# EAGLE design main (EAGLE 5.11)
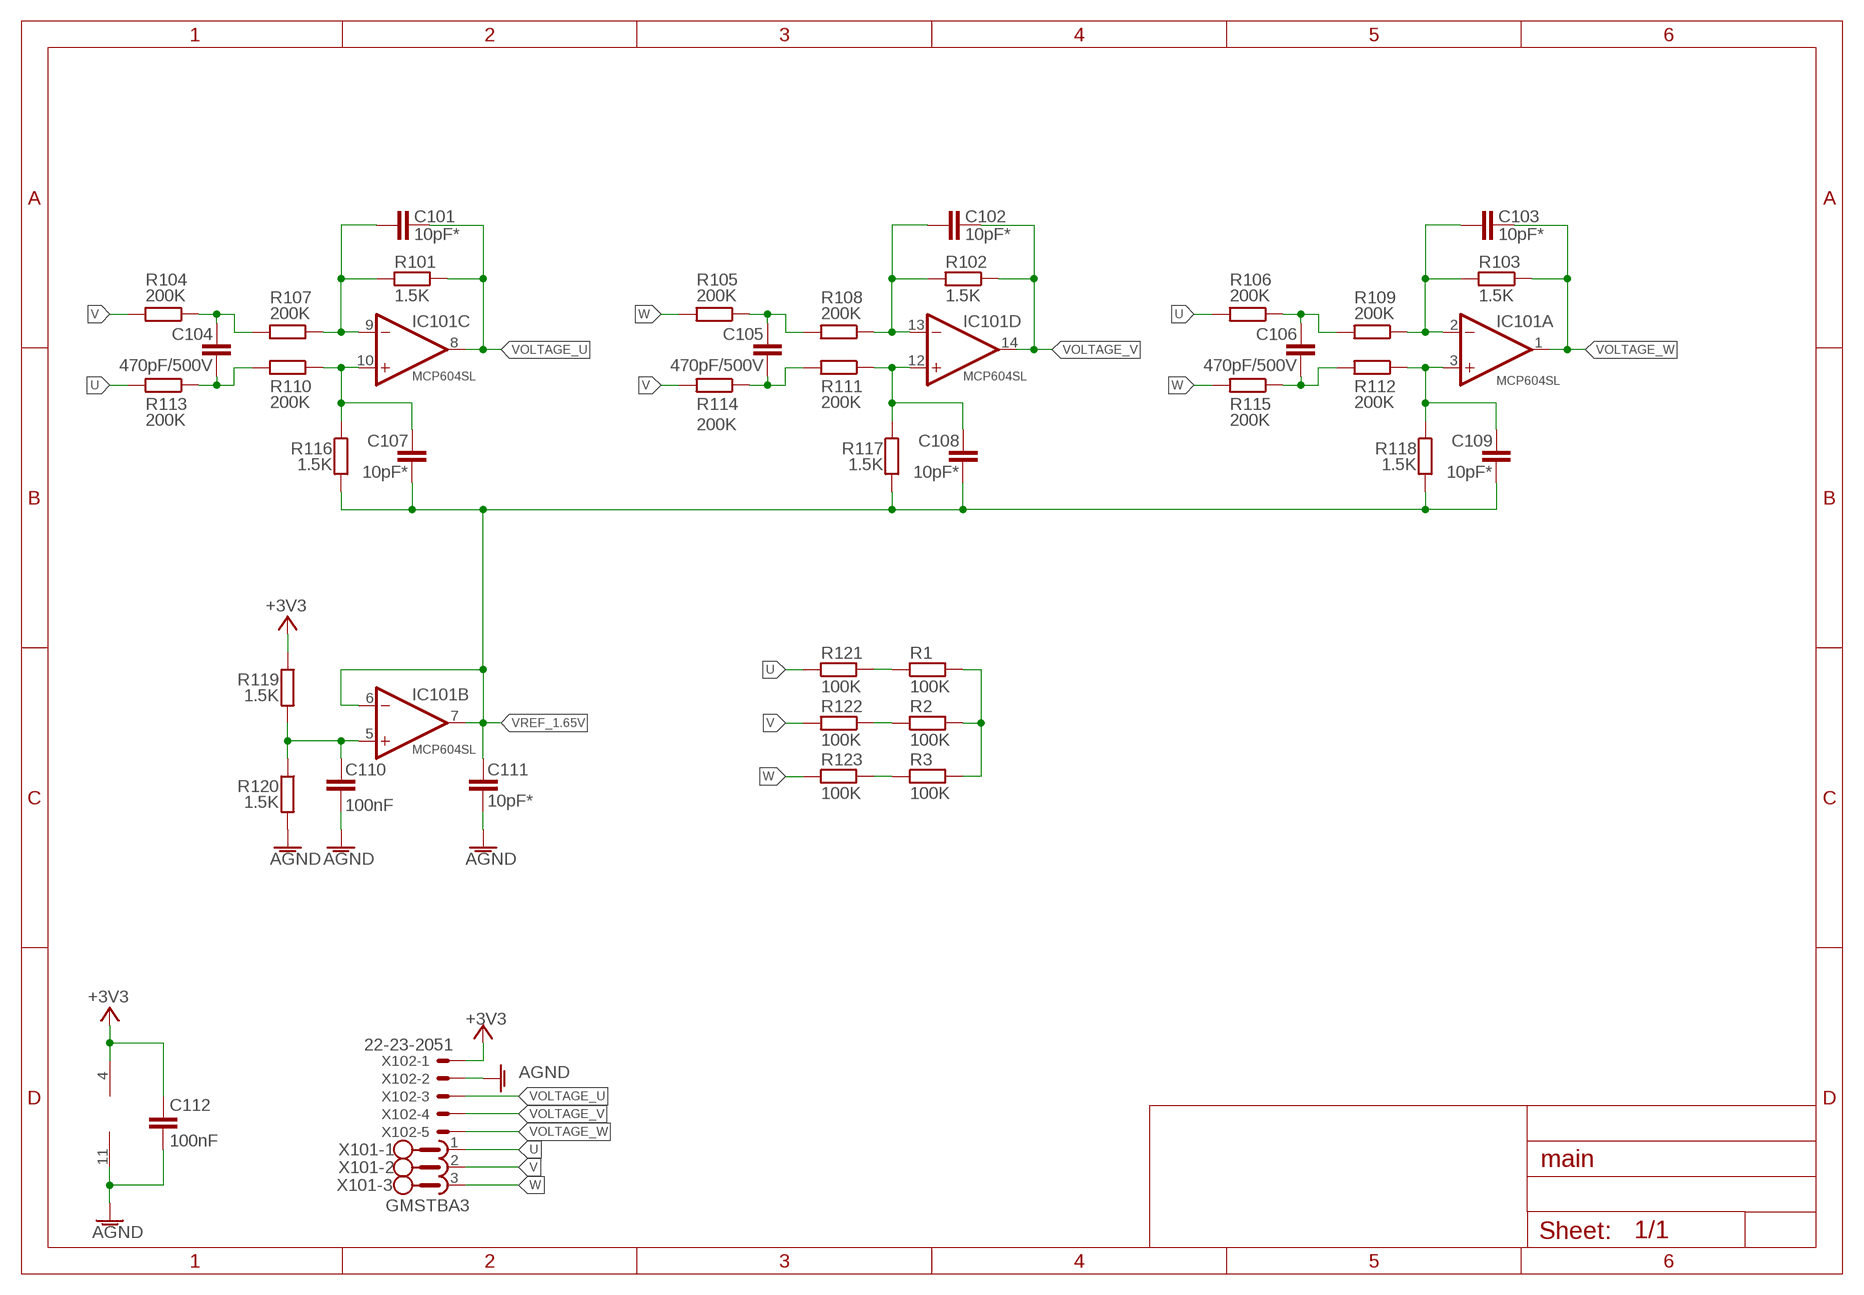
[diagram p0: schematic, sheet 1]

## Parts
C101  10pF*  C-EUC0603  [C0603]
C102  10pF*  C-EUC0603  [C0603]
C103  10pF*  C-EUC0603  [C0603]
C104  470pF/500V  C-EUC1206  [C1206]
C105  470pF/500V  C-EUC1206  [C1206]
C106  470pF/500V  C-EUC1206  [C1206]
C107  10pF*  C-EUC0603  [C0603]
C108  10pF*  C-EUC0603  [C0603]
C109  10pF*  C-EUC0603  [C0603]
C110  100nF  C-EUC0603  [C0603]
C111  10pF*  C-EUC0603  [C0603]
C112  100nF  C-EUC0603  [C0603]
IC101  MCP604SL  [SO14]
R1  100K  R-EU_R1206  [R1206]
R2  100K  R-EU_R1206  [R1206]
R3  100K  R-EU_R1206  [R1206]
R101  1.5K  R-EU_R0603  [R0603]
R102  1.5K  R-EU_R0603  [R0603]
R103  1.5K  R-EU_R0603  [R0603]
R104  200K  R-EU_R1206  [R1206]
R105  200K  R-EU_R1206  [R1206]
R106  200K  R-EU_R1206  [R1206]
R107  200K  R-EU_R1206  [R1206]
R108  200K  R-EU_R1206  [R1206]
R109  200K  R-EU_R1206  [R1206]
R110  200K  R-EU_R1206  [R1206]
R111  200K  R-EU_R1206  [R1206]
R112  200K  R-EU_R1206  [R1206]
R113  200K  R-EU_R1206  [R1206]
R114  200K  R-EU_R1206  [R1206]
R115  200K  R-EU_R1206  [R1206]
R116  1.5K  R-EU_R0603  [R0603]
R117  1.5K  R-EU_R0603  [R0603]
R118  1.5K  R-EU_R0603  [R0603]
R119  1.5K  R-EU_R0603  [R0603]
R120  1.5K  R-EU_R0603  [R0603]
R121  100K  R-EU_R1206  [R1206]
R122  100K  R-EU_R1206  [R1206]
R123  100K  R-EU_R1206  [R1206]
X101  GMSTBA3  [GMSTBA3]
X102  22-23-2051  [22-23-2051]

## Nets
+3V3: C112.1 IC101.4(P:V+) R119.1 X102.1
AGND: C110.2 C111.2 C112.2 IC101.11(P:V-) R120.2 X102.2
N$1: C104.2 R110.2 R113.1
N$2: C110.1 IC101.5(B:+IN) R119.2 R120.1
N$3: C104.1 R104.1 R107.2
N$4: C105.2 R111.2 R114.1
N$5: C105.1 R105.1 R108.2
N$6: C106.1 R106.1 R109.2
N$7: C101.2 IC101.9(C:-IN) R101.2 R107.1
N$8: C106.2 R112.2 R115.1
N$9: R1.1 R121.2
N$10: R2.1 R122.1
N$11: R3.1 R123.2
N$12: R1.2 R2.2 R3.2
N$38: C108.1 IC101.12(D:+IN) R111.1 R117.1
N$74: C102.2 IC101.13(D:-IN) R102.2 R108.1
N$75: C107.1 IC101.10(C:+IN) R110.1 R116.1
N$133: C109.1 IC101.3(A:+IN) R112.1 R118.1
N$134: C103.2 IC101.2(A:-IN) R103.2 R109.1
U: R106.2 R113.2 R121.1 X101.1
V: R104.2 R114.2 R122.2 X101.2
VOLTAGE_U: C101.1 IC101.8(C:OUT) R101.1 X102.3
VOLTAGE_V: C102.1 IC101.14(D:OUT) R102.1 X102.4
VOLTAGE_W: C103.1 IC101.1(A:OUT) R103.1 X102.5
VREF_1.65V: C107.2 C108.2 C109.2 C111.1 IC101.6(B:-IN) IC101.7(B:OUT) R116.2 R117.2 R118.2
W: R105.2 R115.2 R123.1 X101.3

## Library data of the parts
C101-C112 = rcl:C-EU: CAPACITOR, European symbol
IC101 = linear:MCP604: Quad Op Amp 2.7V to 6.0V Single Supply CMOS Source: http://ww1.microchip.com/downloads/en/DeviceDoc/21314g.pdf
R1-R3 R101-R123 = rcl:R-EU_: RESISTOR, European symbol
X101 = con-phoenix-762:GMSTBA3: PHOENIX; MF: FARNELL; MPN: 1757255; OC_FARNELL: 3705183; OC_NEWARK: 71C4162
X102 = con-molex:22-23-2051: .100" (2.54mm) Center Header - 5 Pin; MF: MOLEX; MPN: 22-23-2051; OC_FARNELL: 1462952; OC_NEWARK: 38C9178

## Board
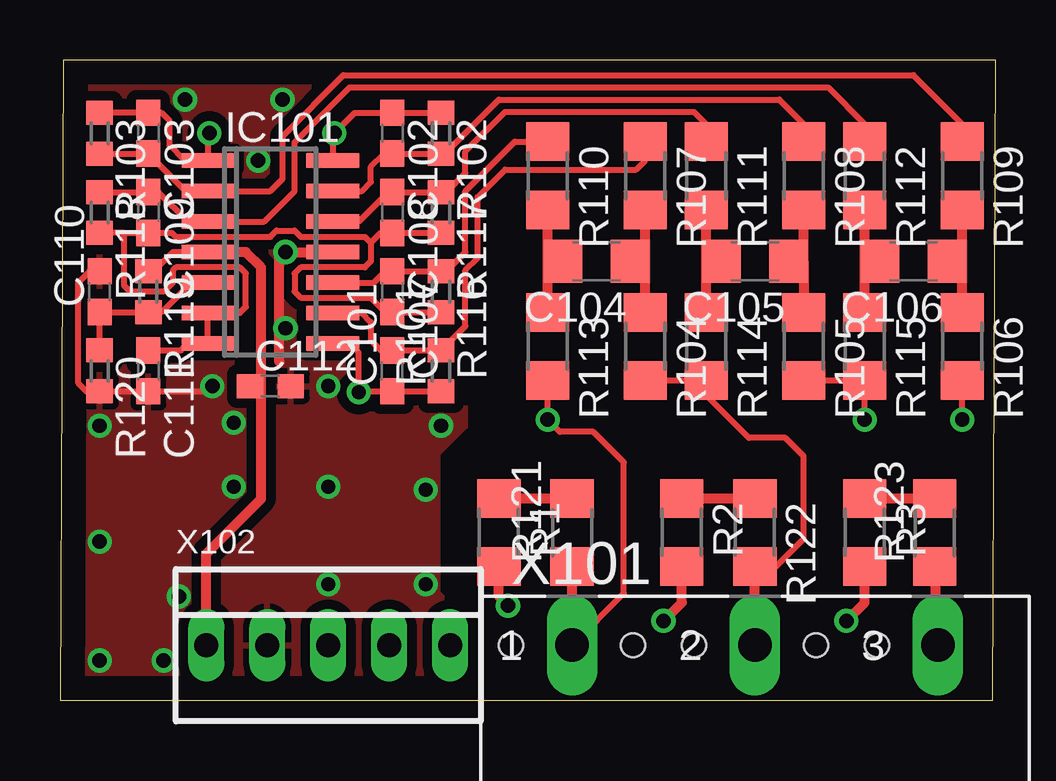
[diagram p1: board, top side]
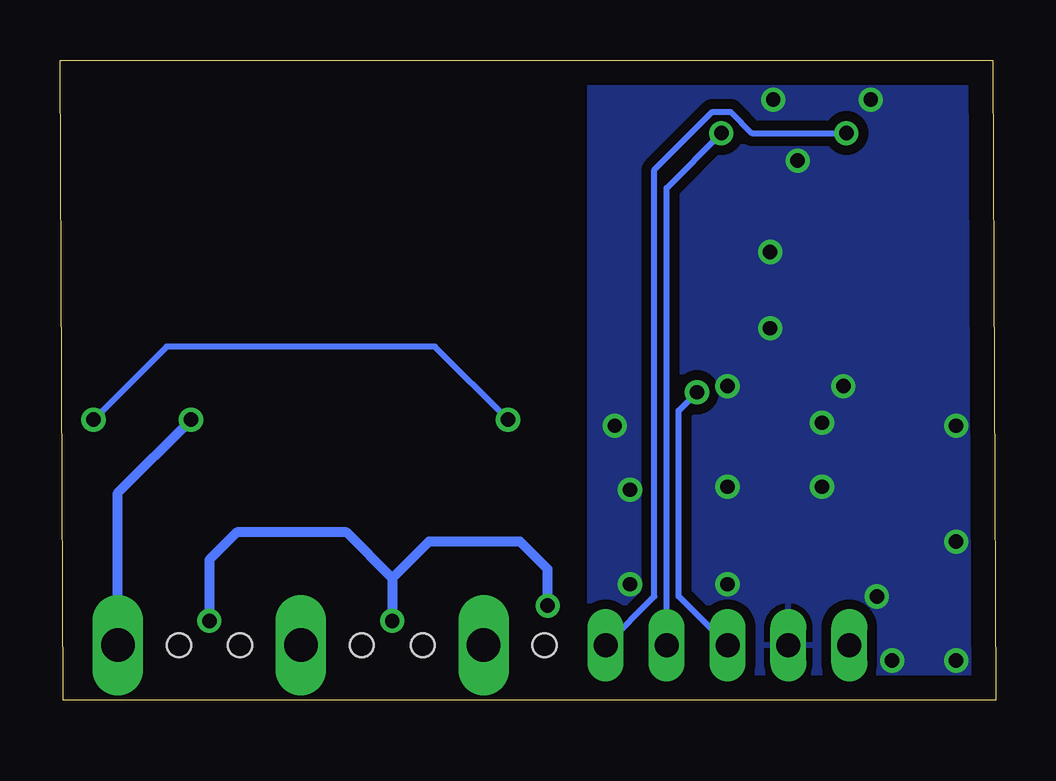
[diagram p2: board, bottom side, seen from below]

Size 38.99 x 26.67 mm. Coordinates in mm from the lower left corner, seen from the top.
Outline: 0,0 38.86,0 38.99,26.67 0.13,26.67 0,0
Copper layers (1*16): Top 0.035mm / dielectric 1.5mm / Bottom 0.035mm
Design rules "default": minimum track width 10mil, minimum drill 24mil, track to track 8mil, track to pad 8mil, pad to pad 8mil, via to via 8mil, smd to smd 8mil, copper to edge 40mil, drill to drill 8mil, minimum pad ring 10mil, minimum via ring 8mil, stop-mask expansion 4mil, vias tented up to drill 0mil, thermal gap 10mil
Holes 1 mm at 18.8,2.29 23.88,2.29 26.42,2.29 31.5,2.29 34.04,2.29

### Footprints (pad centres in the part's own frame; a part is rotated, then mirrored left to right if it is on the bottom)
C0603 = smd 1.1 x 1: 1 -0.85,0; 2 0.85,0
C1206 = smd 1.6 x 1.8: 1 -1.4,0; 2 1.4,0
SO14 = smd 0.6 x 2.2: 1 -3.81,-2.6; 2 -2.54,-2.6; 3 -1.27,-2.6; 4 0,-2.6; 5 1.27,-2.6; 6 2.54,-2.6; 7 3.81,-2.6; 8 3.81,2.6; 9 2.54,2.6; 10 1.27,2.6; 11 0,2.6; 12 -1.27,2.6; 13 -2.54,2.6; 14 -3.81,2.6
R1206 = smd 1.6 x 1.803: 1 -1.422,0; 2 1.422,0
R0603 = smd 1 x 1.1: 1 -0.85,0; 2 0.85,0
GMSTBA3 = drill 1.397 long: 1 -7.62,5.08; 2 0,5.08; 3 7.62,5.08
22-23-2051 = drill 1 long: 1 -5.08,0; 2 -2.54,0; 3 0,0; 4 2.54,0; 5 5.08,0

### Placement (x,y rotation side)
C101  13.84,13.72 90 top
C102  13.84,23.62 270 top
C103  3.68,23.62 270 top
C104  22.35,18.29 180 top
C105  28.96,18.29 180 top
C106  35.56,18.29 180 top
C107  13.84,17.02 270 top
C108  13.84,20.32 270 top
C109  3.68,20.32 270 top
C110  1.65,17.02 90 top
C111  3.68,13.72 270 top
C112  8.76,13.08 0 top
IC101  8.76,18.67 270 top
R1  18.29,6.99 270 top
R2  25.91,6.99 270 top
R3  33.53,6.99 270 top
R101  15.88,13.72 90 top
R102  15.88,23.62 270 top
R103  1.65,23.62 270 top
R104  24.38,14.73 270 top
R105  30.99,14.73 270 top
R106  37.59,14.73 270 top
R107  24.38,21.84 270 top
R108  30.99,21.84 270 top
R109  37.59,21.84 270 top
R110  20.32,21.84 270 top
R111  26.92,21.84 270 top
R112  33.53,21.84 270 top
R113  20.32,14.73 270 top
R114  26.92,14.73 270 top
R115  33.53,14.73 270 top
R116  15.88,17.02 270 top
R117  15.88,20.32 270 top
R118  1.65,20.32 270 top
R119  3.68,17.02 270 top
R120  1.65,13.72 270 top
R121  21.34,6.99 90 top
R122  28.96,6.99 270 top
R123  36.45,6.99 90 top
X101  28.96,-2.79 0 top
X102  11.18,2.29 0 top

### Tracks (layer width: path | path; a pad name or v marks a point on that pad's centre or on a via)
+3V3
  Top 0.254: R119.1 3.9,17.87 4.7,18.67 IC101.4
  Top 0.406: IC101.4 7.75,18.67 8.38,18.03 8.38,13.08 | 8.38,13.08 C112.1 | X102.1 6.1,6.1 8.38,8.38 8.38,13.08
AGND  (via drill 0.6)
  Top 0.254: C110.2 1.23,17.87 0.76,17.4 0.76,13.21 1.1,12.87 R120.2 C111.2 6.13,12.87 v6.35,13.08
  Top 0.406: IC101.11 9.14,18.67 9.14,14.1
  other vias: 11.18,13.08 15.24,4.83 15.88,11.43 11.18,4.83 11.18,8.89 15.24,8.76 1.65,1.65 4.32,1.65 1.65,11.43 7.24,8.89 7.24,11.56 1.65,6.6 4.95,4.32 9.4,15.49 9.4,18.67 9.27,25.02 5.21,25.02 8.26,22.48
  pour Top (isolate 0.406): 0,0 16.89,0 16.89,3.3 15.75,4.45 15.75,10.29 16.89,11.43 16.89,26.42 0,26.42
  pour Bottom (isolate 0.406): 0,0 16.89,0 16.89,26.42 0,26.42
N$1
  Top 0.406: R113.1 20.32,18.29 | 20.32,18.29 R110.2 | 20.32,18.29 C104.2
N$2
  Top 0.254: R120.1 C110.1 R119.2 4.23,16.17 5.46,17.4 IC101.5
N$3
  Top 0.406: R104.1 24.38,18.29 | 24.38,18.29 R107.2 | 24.38,18.29 C104.1
N$4
  Top 0.406: R114.1 26.92,18.29 | 26.92,18.29 R111.2 | 26.92,18.29 C105.2
N$5
  Top 0.406: 30.99,18.29 R105.1 | 30.99,18.29 R108.2 | C105.1 30.99,18.29
N$6
  Top 0.406: R106.1 37.59,18.29 | 37.59,18.29 R109.2 | 37.59,18.29 C106.1
N$7
  Top 0.254: IC101.9 12.57,16.13 12.95,15.75 12.95,14.99 13.37,14.57 C101.2 R101.2 16.89,15.58 16.89,17.91 17.4,18.41 17.4,20.95 18.54,22.1 24,22.1 24.38,22.48 R107.1
N$8
  Top 0.406: R115.1 33.53,18.29 | 33.53,18.29 R112.2 | 33.53,18.29 C106.2
N$9
  Top 0.406: R1.1 R121.2
N$10
  Top 0.406: R2.1 R122.1
N$11
  Top 0.406: R3.1 R123.2
N$12  (via drill 0.6)
  Top 0.406: R3.2 33.53,4.06 v32.77,3.3 | R2.2 25.91,4.06 v25.15,3.3 | R1.2 18.29,4.32 v18.67,3.94
  Bottom 0.406: v32.77,3.3 32.77,5.84 31.62,6.99 27.05,6.99 25.15,5.08 | 25.15,5.08 v25.15,3.3 | v18.67,3.94 18.67,5.46 19.81,6.6 23.62,6.6 25.15,5.08
N$38
  Top 0.254: IC101.12 12.45,19.94 13.68,21.17 C108.1 R117.1 16.09,21.17 16.89,21.97 16.89,22.86 18.54,24.51 26.42,24.51 26.92,24 R111.1
N$74
  Top 0.254: IC101.13 12.57,21.21 12.95,21.59 12.95,22.23 13.5,22.77 C102.2 R102.2 16.04,22.77 18.29,25.02 29.97,25.02 30.99,24 R108.1
N$75
  Top 0.254: IC101.10 13.08,17.4 13.55,17.87 C107.1 R116.1 16.09,17.87 16.89,18.67 16.89,21.21 18.95,23.27 R110.1
N$133
  Top 0.254: R118.1 C109.1 4.1,21.17 5.33,19.94 IC101.3 7.11,19.94 8.51,19.94 9.78,21.21 9.78,23.24 12.06,25.53 32,25.53 33.53,24 R112.1
N$134
  Top 0.254: R103.2 C103.2 5.25,21.21 IC101.2 8.76,21.21 9.27,21.72 9.27,23.5 11.81,26.04 35.56,26.04 37.59,24 R109.1
U  (via drill 0.6)
  Top 0.254: R113.2 v20.32,11.68 20.45,11.56 20.83,11.18 22.23,11.18 23.5,9.91 23.5,4.45 X101.1 | v37.59,11.68 R106.2
  Top 0.406: X101.1 R121.1
  Bottom 0.254: v20.32,11.68 23.37,14.73 34.54,14.73 v37.59,11.68
V
  Top 0.254: R104.2 R114.2 26.92,12.7 28.7,10.92 30.23,10.92 30.99,10.16 30.99,6.73 29.82,5.56 R122.2
  Top 0.406: X101.2 R122.2
VOLTAGE_U  (via drill 0.6)
  Top 0.254: R101.1 C101.1 12.48,12.87 arc90 v12.45,12.83 12.45,14.48 12.06,14.86 IC101.8
  Bottom 0.254: X102.3 13.21,4.32 13.21,12.06 v12.45,12.83
VOLTAGE_V  (via drill 0.6)
  Top 0.254: R102.1 C102.1 12.28,24.47 v11.43,23.62 11.36,23.55 IC101.14
  Bottom 0.254: X102.4 13.72,21.34 v11.43,23.62
VOLTAGE_W  (via drill 0.6)
  Top 0.254: R103.1 C103.1 4.23,24.47 4.57,24.13 4.57,23.11 5.21,22.48 IC101.1 6.16,23.56 v6.22,23.62
  Bottom 0.254: X102.5 14.22,4.32 14.22,22.1 11.81,24.51 11.05,24.51 10.16,23.62 v6.22,23.62
VREF_1.65V
  Top 0.254: R117.2 C108.2 13.37,19.47 12.95,19.05 | 2.67,19.47 C109.2 4.66,19.47 4.83,19.3 8.76,19.3 9.02,19.56 9.78,19.56 10.03,19.3 12.7,19.3 12.95,19.05 | 2.67,19.47 R118.2 | C111.1 5.04,14.57 5.33,14.86 IC101.7 IC101.6 7.49,16.13 7.75,16.38 7.75,17.78 7.49,18.03 4.83,18.03 4.7,17.91 4.7,17.4 4.32,17.02 2.92,17.02 2.67,17.27 2.67,19.47 | 12.95,19.05 12.95,18.29 12.7,18.03 10.03,18.03 9.78,17.78 9.78,17.02 10.03,16.76 12.95,16.76 13.55,16.17 C107.2 R116.2
W  (via drill 0.6)
  Top 0.254: R105.2 R115.2 v33.53,11.68
  Top 0.406: X101.3 R123.1
  Bottom 0.406: v33.53,11.68 36.58,8.64 X101.3